# EAGLE schematic LCD breakout (EAGLE 7.2.0)
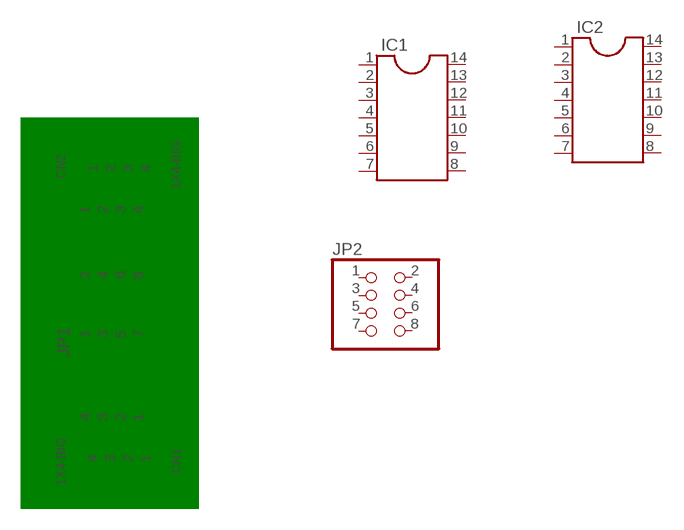
[diagram p0: schematic, sheet 1]

## Parts
CN1  1X4-BIG  [1X04-BIG]
CN2  1X4-BIG  [1X04-BIG]
IC1  DIL14  [DIL14]
IC2  DIL14  [DIL14]
JP1  PINHD-2X4  [2X04]
JP2  PINHD-2X4  [2X04]

## Nets
N$3: CN2.3 JP1.6
N$4: JP1.8
N$5: JP1.1
N$6: JP1.3
N$8: JP1.7
Unconnected: CN1.1 CN1.2 CN1.3 CN1.4 CN2.1 CN2.2 CN2.4 IC1.1 IC1.2 IC1.3 IC1.4 IC1.5 IC1.6 IC1.7 IC1.8 IC1.9 IC1.10 IC1.11 IC1.12 IC1.13 IC1.14 IC2.1 IC2.2 IC2.3 IC2.4 IC2.5 IC2.6 IC2.7 IC2.8 IC2.9 IC2.10 IC2.11 IC2.12 IC2.13 IC2.14 JP1.2 JP1.4 JP1.5 JP2.1 JP2.2 JP2.3 JP2.4 JP2.5 JP2.6 JP2.7 JP2.8

## Library data of the parts
CN1 CN2 = adafruit:1X4: 4-pin connector
IC1 IC2 = ic-package:DIL14: Dual In Line / Socket
JP1 JP2 = adafruit:PINHD-2X4: PIN HEADER